# EAGLE design FIDO2AUTH_0022 (EAGLE 7.7.0)

## Sheet 1 of 3
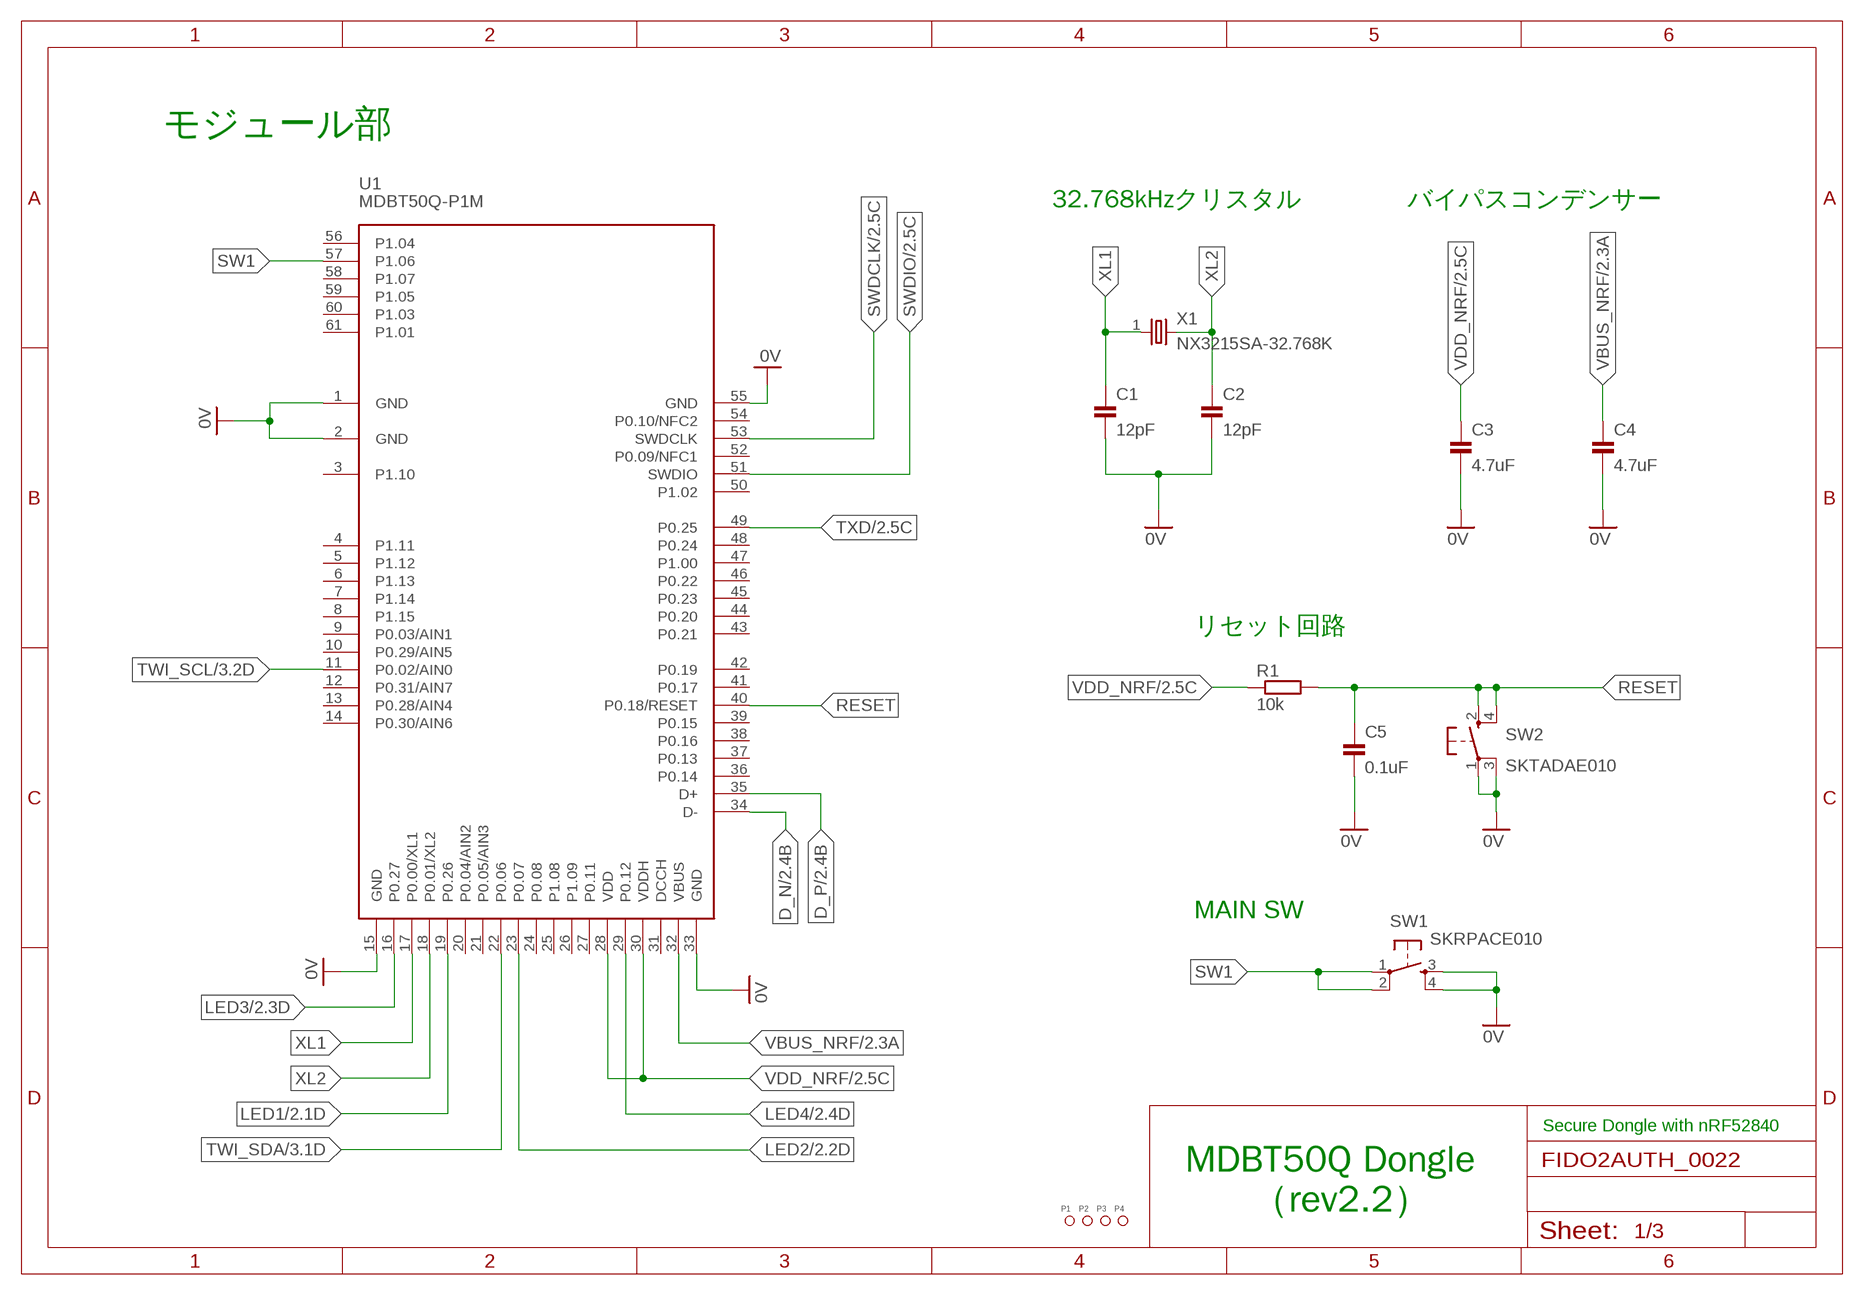
[diagram p0: schematic, sheet 1]

### Parts
C1  12pF  CAP_0603N  [C0603N]
C2  12pF  CAP_0603N  [C0603N]
C3  4.7uF  CAP_0603N  [C0603N]
C4  4.7uF  CAP_0603N  [C0603N]
C5  0.1uF  CAP_0402N  [C0402N]
P1  0  PAD-MARK  [ROUND-MARK-1.0]
P2  0  PAD-MARK  [ROUND-MARK-1.0]
P3  0  PAD-MARK  [ROUND-MARK-1.0]
P4  0  PAD-MARK  [ROUND-MARK-1.0]
R1  10k  RESISTOR_0402N  [R0402N]
SW1  SKRPACE010  [SKRPACE010]
SW2  SKTADAE010  [SKTADAE010]
U1  MDBT50Q-P1M  [MDBT50Q-P1M]
X1  NX3215SA-32.768K  [NX3215]

### Nets
0V: C1.2 C2.2 C3.2 C4.2 C5.2 SW1.3(S) SW1.4(S1) SW2.1(P) SW2.3(P1) U1.1(GND) U1.2(GND) U1.15(GND) U1.33(GND) U1.55(GND) ; also sheet 2,3
D_N: U1.34(D-) ; also sheet 2
D_P: U1.35(D+) ; also sheet 2
LED1: U1.19(P0.26) ; also sheet 2
LED2: U1.23(P0.07) ; also sheet 2
LED3: U1.16(P0.27) ; also sheet 2
LED4: U1.29(P0.12) ; also sheet 2
RESET: C5.1 R1.2 SW2.2(S) SW2.4(S1) U1.40(P0.18/RESET)
SW1: SW1.1(P) SW1.2(P1) U1.57(P1.06)
SWDCLK: U1.53(SWDCLK) ; also sheet 2
SWDIO: U1.51(SWDIO) ; also sheet 2
TWI_SCL: U1.11(P0.02/AIN0) ; also sheet 3
TWI_SDA: U1.22(P0.06) ; also sheet 3
TXD: U1.49(P0.25) ; also sheet 2
VBUS_NRF: C4.1 U1.32(VBUS) ; also sheet 2,3
VDD_NRF: C3.1 R1.1 U1.28(VDD) U1.30(VDDH) ; also sheet 2,3
XL1: C1.1 U1.17(P0.00/XL1) X1.1
XL2: C2.1 U1.18(P0.01/XL2) X1.2
Unconnected: U1.3(P1.10) U1.4(P1.11) U1.5(P1.12) U1.6(P1.13) U1.7(P1.14) U1.8(P1.15) U1.9(P0.03/AIN1) U1.10(P0.29/AIN5) U1.12(P0.31/AIN7) U1.13(P0.28/AIN4) U1.14(P0.30/AIN6) U1.20(P0.04/AIN2) U1.21(P0.05/AIN3) U1.24(P0.08) U1.25(P1.08) U1.26(P1.09) U1.27(P0.11) U1.31(DCCH) U1.36(P0.14) U1.37(P0.13) U1.38(P0.16) U1.39(P0.15) U1.41(P0.17) U1.42(P0.19) U1.43(P0.21) U1.44(P0.20) U1.45(P0.23) U1.46(P0.22) U1.47(P1.00) U1.48(P0.24) U1.50(P1.02) U1.52(P0.09/NFC1) U1.54(P0.10/NFC2) U1.56(P1.04) U1.58(P1.07) U1.59(P1.05) U1.60(P1.03) U1.61(P1.01)

### Notes on the sheet
- モジュール部
- 32.768kHzクリスタル | バイパスコンデンサー
- リセット回路
- MAIN SW
- Secure Dongle with nRF52840
- MDBT50Q Dongle
        （rev2.2）

## Sheet 2 of 3
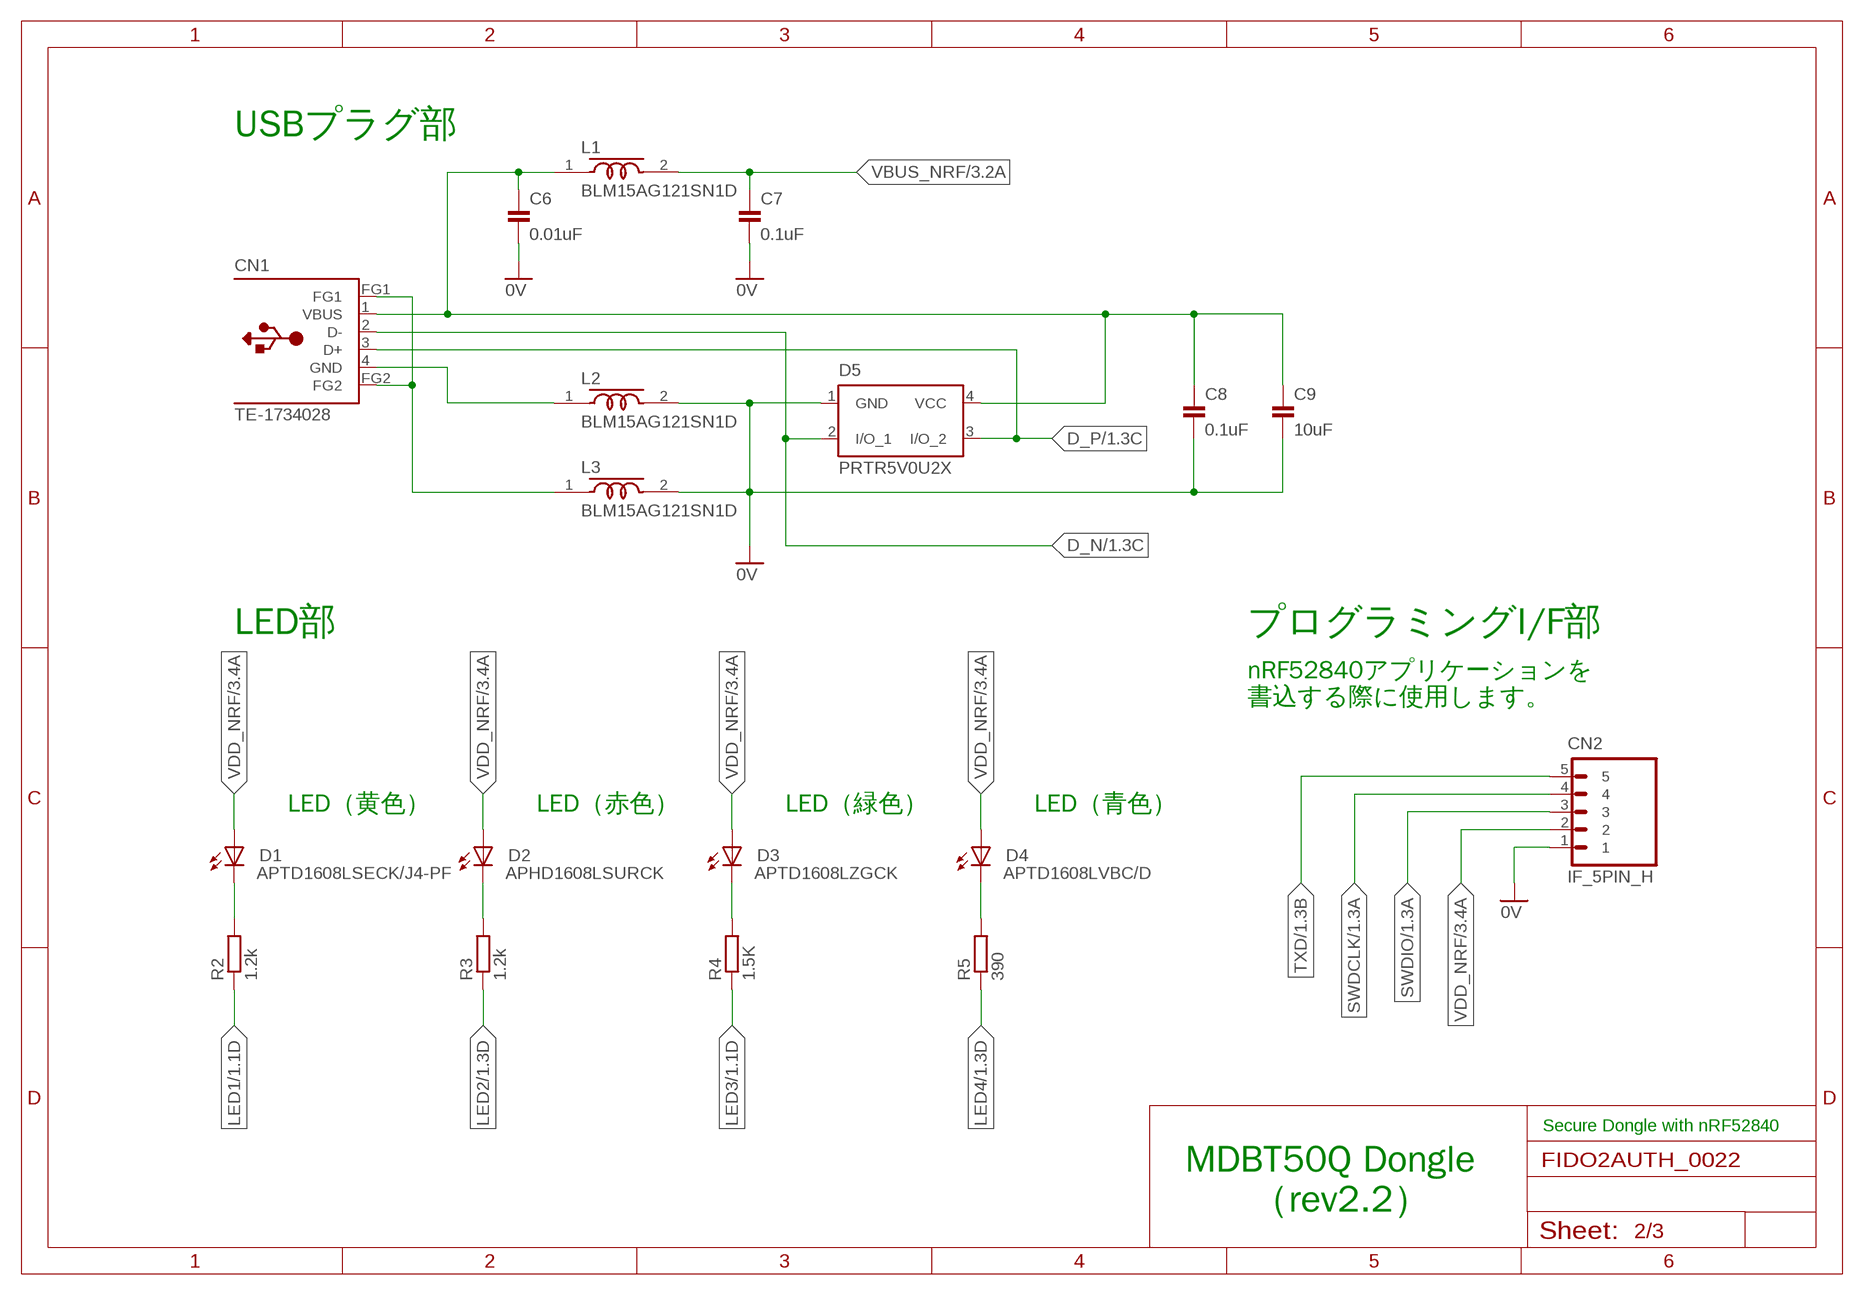
[diagram p1: schematic, sheet 2]

### Parts
C6  0.01uF  CAP_0402N  [C0402N]
C7  0.1uF  CAP_0402N  [C0402N]
C8  0.1uF  CAP_0402N  [C0402N]
C9  10uF  CAP_0603N  [C0603N]
CN1  TE-1734028  [TE-1734028]
CN2  IF_5PIN_H  [HEADER_5PIN]
D1  APTD1608LSECK/J4-PF  [APTD1608]
D2  APHD1608LSURCK  [APTD1608]
D3  APTD1608LZGCK  [APTD1608]
D4  APTD1608LVBC/D  [APTD1608]
D5  PRTR5V0U2X  [SOT143B]
L1  BLM15AG121SN1D  [C0402N]
L2  BLM15AG121SN1D  [C0402N]
L3  BLM15AG121SN1D  [C0402N]
R2  1.2k  RESISTOR_0402N  [R0402N]
R3  1.2k  RESISTOR_0402N  [R0402N]
R4  1.5K  RESISTOR_0402N  [R0402N]
R5  390  RESISTOR_0402N  [R0402N]

### Nets
0V: C6.2 C7.2 C8.2 C9.2 CN2.1 D5.1(GND) L2.2 L3.2 ; also sheet 1,3
D_N: CN1.2(D-) D5.2(I/O_1) ; also sheet 1
D_P: CN1.3(D+) D5.3(I/O_2) ; also sheet 1
LED1: R2.1 ; also sheet 1
LED2: R3.1 ; also sheet 1
LED3: R4.1 ; also sheet 1
LED4: R5.1 ; also sheet 1
N$1: D4.C R5.2
N$2: CN1.4(GND) L2.1
N$3: CN1.FG1 CN1.FG2 L3.1
N$6: D3.C R4.2
N$7: D2.C R3.2
N$8: D1.C R2.2
SWDCLK: CN2.4 ; also sheet 1
SWDIO: CN2.3 ; also sheet 1
TXD: CN2.5 ; also sheet 1
VBUS: C6.1 C8.1 C9.1 CN1.1(VBUS) D5.4(VCC) L1.1
VBUS_NRF: C7.1 L1.2 ; also sheet 1,3
VDD_NRF: CN2.2 D1.A D2.A D3.A D4.A ; also sheet 1,3

### Notes on the sheet
- USBプラグ部
- LED部 | プログラミングI/F部
- nRF52840アプリケーションを
  書込する際に使用します。
- LED（黄色） | LED（赤色） | LED（緑色） | LED（青色）
- Secure Dongle with nRF52840
- MDBT50Q Dongle
        （rev2.2）

## Sheet 3 of 3
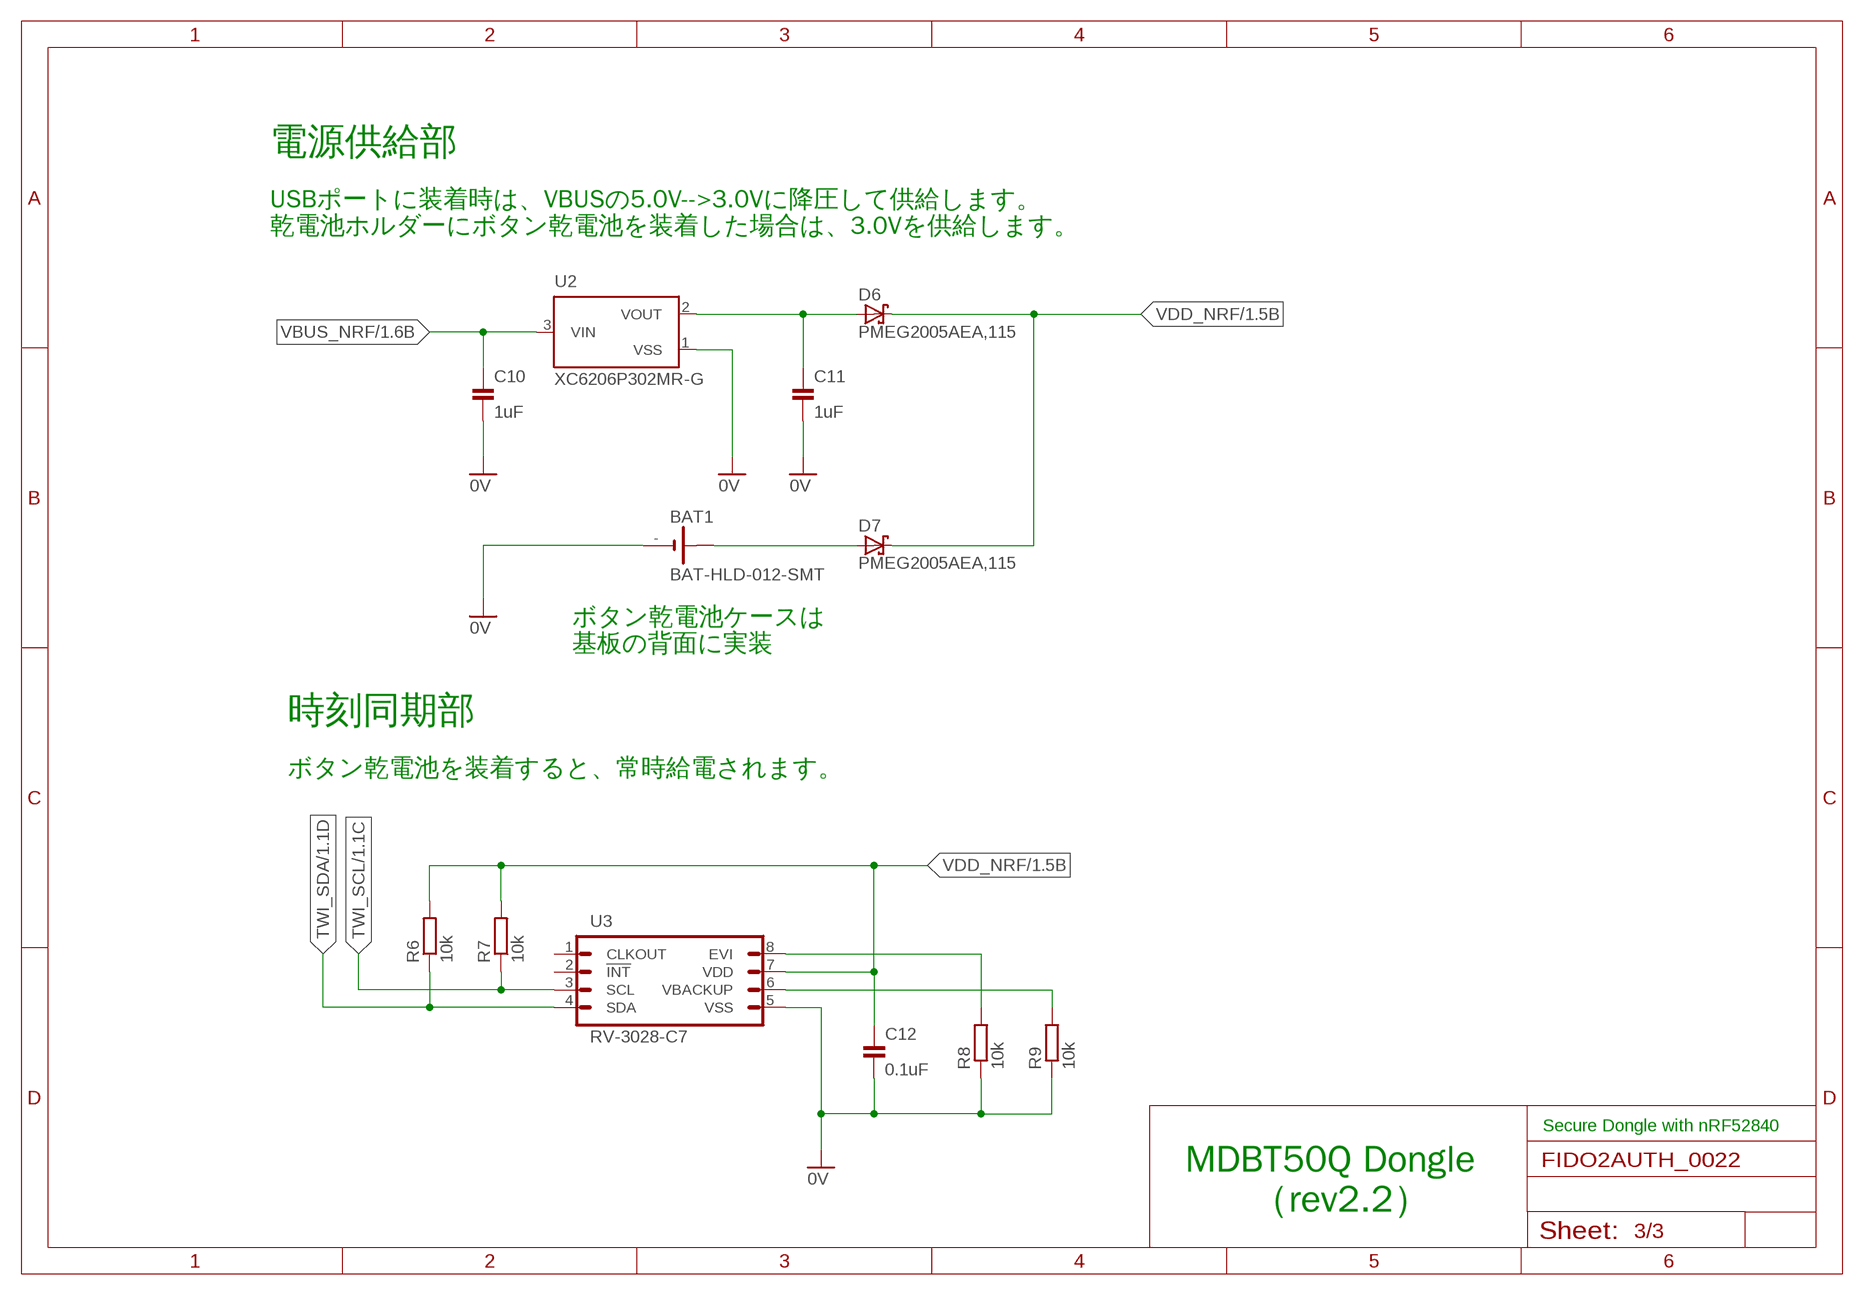
[diagram p2: schematic, sheet 3]

### Parts
BAT1  BAT-HLD-012-SMT  [BAT-HLD-012-SMT]
C10  1uF  CAP_0603N  [C0603N]
C11  1uF  CAP_0603N  [C0603N]
C12  0.1uF  CAP_0402N  [C0402N]
D6  PMEG2005AEA,115  [SOD323-W]
D7  PMEG2005AEA,115  [SOD323-W]
R6  10k  RESISTOR_0402N  [R0402N]
R7  10k  RESISTOR_0402N  [R0402N]
R8  10k  RESISTOR_0402N  [R0402N]
R9  10k  RESISTOR_0402N  [R0402N]
U2  XC6206P302MR-G  [SOT23]
U3  RV-3028-C7  [SON-8]

### Nets
0V: BAT1.- C10.2 C11.2 C12.2 R8.1 R9.1 U2.1(VSS) U3.5(VSS) ; also sheet 1,2
N$4: C11.1 D6.A U2.2(VOUT)
N$5: BAT1.+@2(+) D7.A
N$9: R9.2 U3.6(VBACKUP)
N$10: R8.2 U3.8(EVI)
TWI_SCL: R7.1 U3.3(SCL) ; also sheet 1
TWI_SDA: R6.1 U3.4(SDA) ; also sheet 1
VBUS_NRF: C10.1 U2.3(VIN) ; also sheet 1,2
VDD_NRF: C12.1 D6.C D7.C R6.2 R7.2 U3.7(VDD) ; also sheet 1,2
Unconnected: U3.1(CLKOUT) U3.2(!INT!)

### Notes on the sheet
- 電源供給部
- USBポートに装着時は、VBUSの5.0V-->3.0Vに降圧して供給します。
  乾電池ホルダーにボタン乾電池を装着した場合は、3.0Vを供給します。
- ボタン乾電池ケースは
  基板の背面に実装
- 時刻同期部
- ボタン乾電池を装着すると、常時給電されます。
- Secure Dongle with nRF52840
- MDBT50Q Dongle
        （rev2.2）

## Library data of the parts
BAT1 = Connectors:BAT-HLD-012-SMT: ボタン電池ホルダー(CR1216/1225)
C1-C12 = Parts:CAP: コンデンサー
CN1 = Connectors:TE-1734028: USB connector plug TE Connectivity
CN2 = Connectors:IF_5PIN: 5-pin インターフェース
D1 D3 D4 = Parts:APTD1608: 発光ダイオード
D2 = Parts:APHD1608: 発光ダイオード
D5 = Parts:PRTR5V0U2X: ESD protection diode
D6 D7 = Parts:PMEG2005: ショットキーダイオード If - 順電流: 500 mA Vrrm - 繰返し逆電圧: 20 V Vf - 順電圧: 0.39 V Ifsm - 順方向サージ電流: 10 A 最低動作温度: - 65 C 最高動作温度: + 150 C
L1-L3 = Parts:BLM15AG: フェライトビーズ EMIFIL®
P1-P4 = Generic:PAD-MARK; PARTNO: DNP
R1-R9 = Parts:RESISTOR: 抵抗器
SW1 = Parts:SKRPACE010: 表面実装用タクトスイッチ ４．２×３．２ｍｍ小型重作動力タイプ ・作動力：２．５５Ｎ ・操作方向：垂直 ・移動量：０．２ｍｍ ・動作寿命：５０，０００ｃｙｃｌｅｓ （５ｍＡ ５ＶＤＣ） ・初期接触抵抗：最大５００ｍΩ
SW2 = Parts:SKTADAE010: 表面実装用タクトスイッチ 2.6×1.6ｍｍ小型重作動力タイプ ・作動力：2.4 N ・操作方向：垂直 ・移動量：0.11 mm ・定格：50 mA 12 VDC
U1 = Modules:MDBT50Q-P1M: MDBT50Q – P1M (PCB Antenna) Bluetooth 5, IEEE 802.15.4, 2.4 GHz transceiver ARM Cortex –M4 32-bit processor with FPU, 64 MHz Memory: 1MB flash / 256KB RAM ‧Supply voltage range 1.7V to 5.5V ‧On-chip DC/DC and LDO regulators with automated low current modes ‧Regulated supply for external components from 1.8V to 3.3V ‧0.4uA at 3V in System OFF mode, no RAM retention ‧1.5uA at 3V in System ON mode, no RAM retention, wake on RTC Working distance 1Mbps: up to 250 meters in open space 2Mbps: up to 120 meters in open space
U2 = Parts:XC6206: 電圧レギュレータ 出力電圧: 3.3 V 出力電流: 200 mA 入力電圧最大値: 6 V 最小入力電圧: 1.8 V 動作供給電流: 1 uA 最低動作温度: - 40 C 最高動作温度: + 85 C
U3 = ICs:RV-3028-C7: Extreme Low Power RTC Module Supply Voltage: 1.2 V 〜 5.5 V Operating Temperature: - 40 C 〜 + 85 C 3.2 mm x 1.5 mm
X1 = Parts:NX3215SA: 水晶振動子 周波数 32.768kHz 周波数公差 ±20ppm 負荷容量 6pF ESR（等価直列抵抗） 70 kOhms 動作温度 -40°C～85°C

## Board
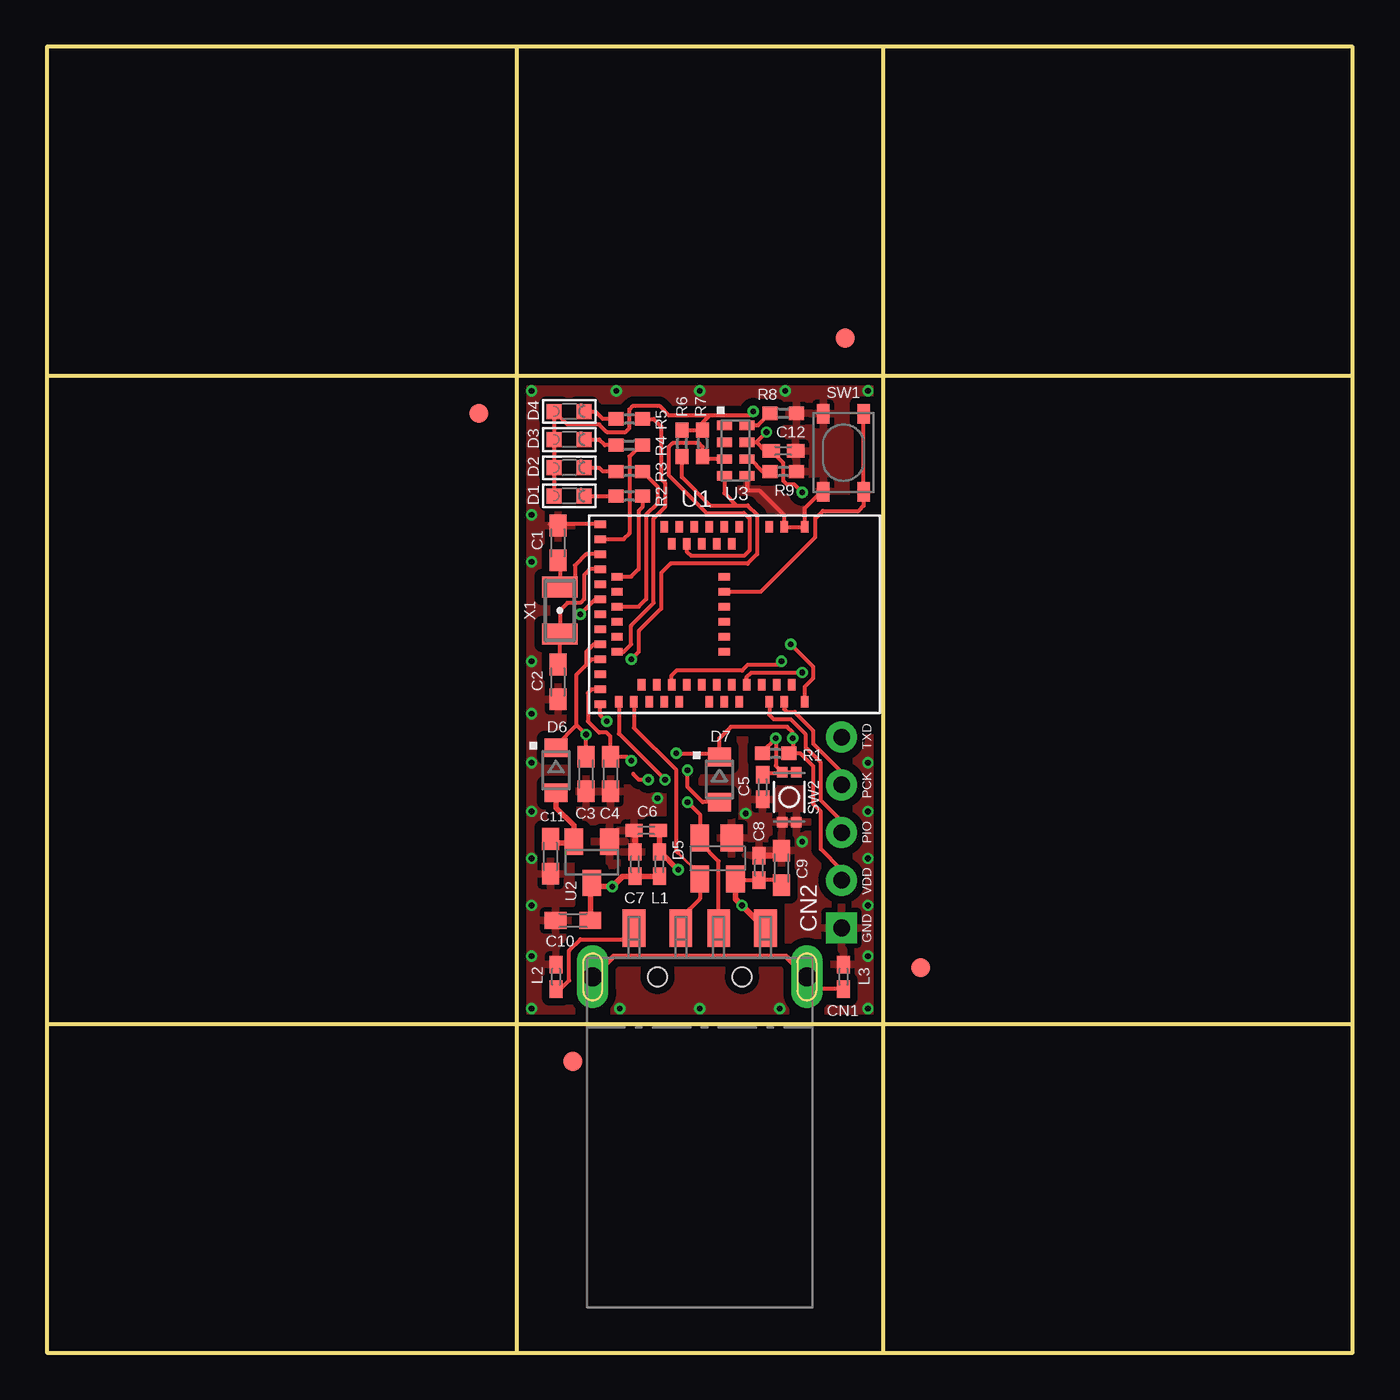
[diagram p3: board, top side]
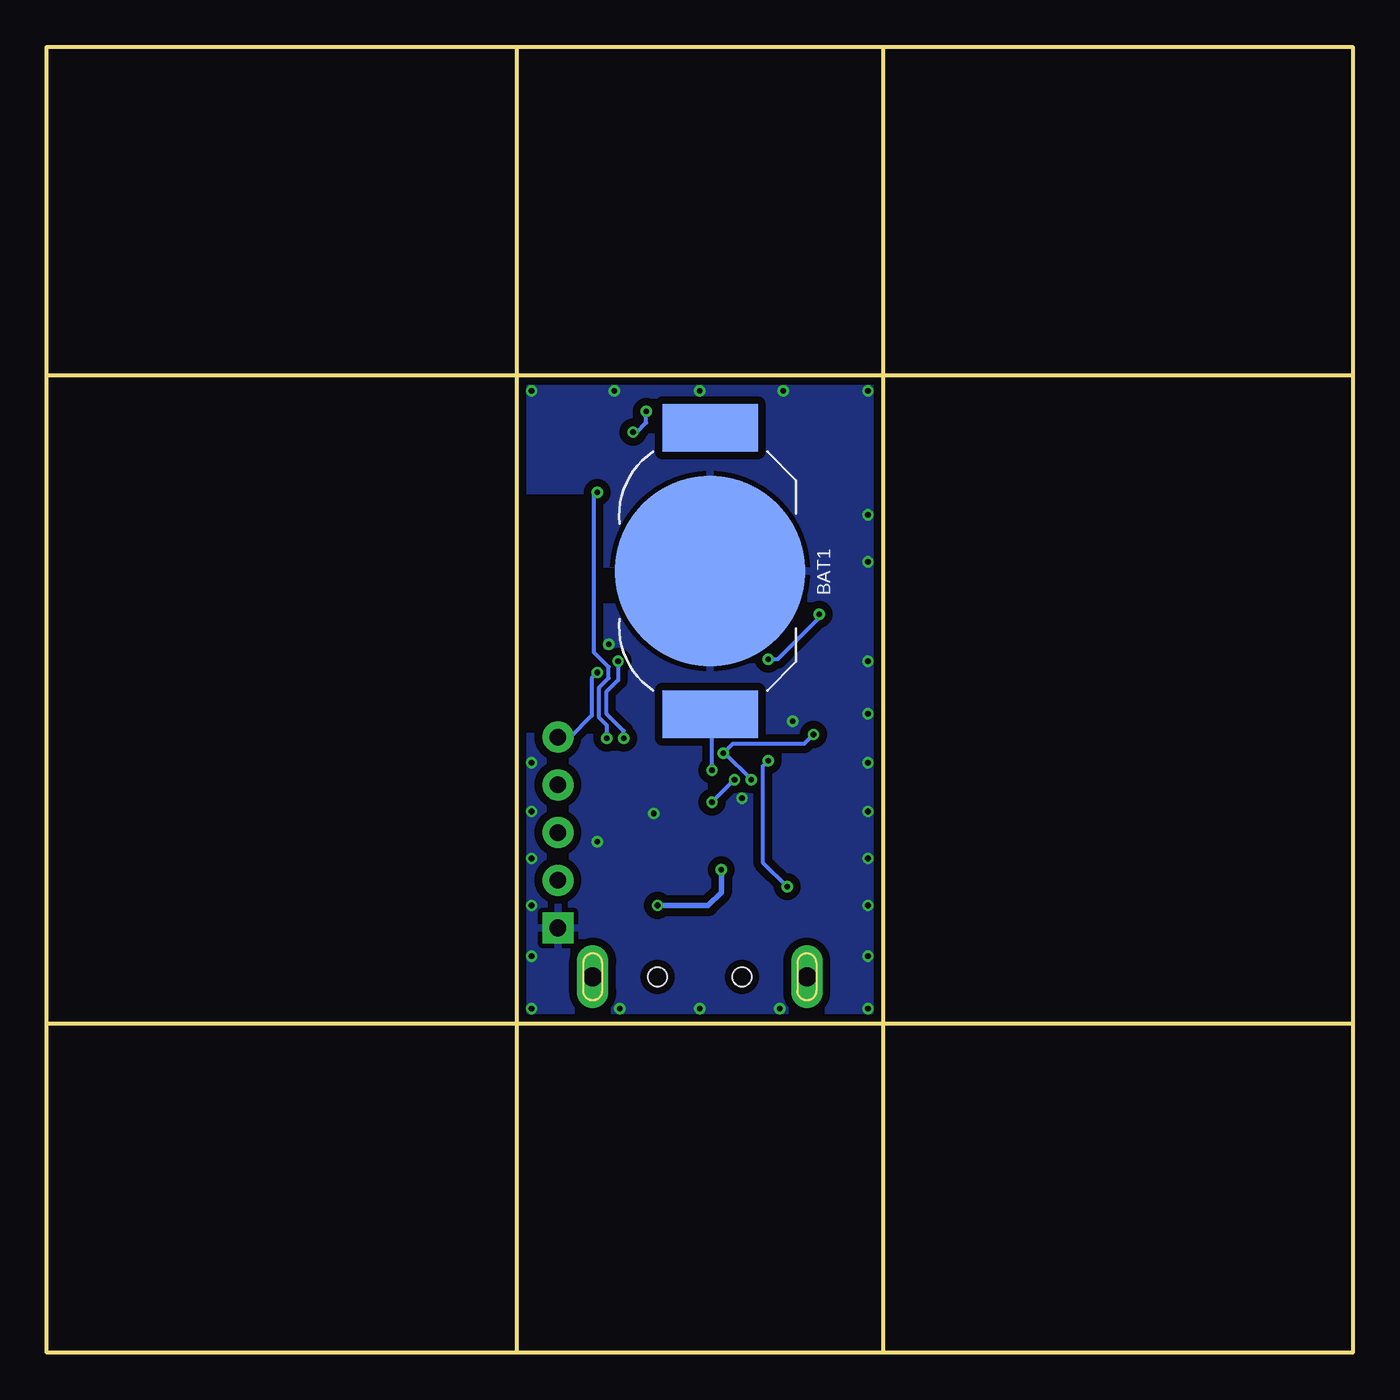
[diagram p4: board, bottom side, seen from below]

Size 69.5 x 69.5 mm. Coordinates in mm from the lower left corner, seen from the top.
Outline: 0,17.5 69.5,17.5
Outline: 0,52 69.5,52
Outline: 25,69.5 25,0
Outline: 44.5,69.5 44.5,0
Outline: 0,0 69.5,0 69.5,69.5 0,69.5 0,0
Copper layers (1*16): Top 0.035mm / dielectric 1.5mm / Bottom 0.035mm
Design rules "SeeedStudio_2layer_DRU_no_angle_20140221 *": minimum track width 6mil, minimum drill 0.3mm, track to track 6mil, track to pad 6mil, pad to pad 6mil, via to via 6mil, smd to smd 0mil, copper to edge 10mil, drill to drill 10mil, minimum pad ring 10mil, minimum via ring 6mil, stop-mask expansion 2mil, vias tented up to drill 100mil, thermal gap 10mil

### Footprints (pad centres in the part's own frame; a part is rotated, then mirrored left to right if it is on the bottom)
BAT-HLD-012-SMT = smd 2.54 x 5.08: +@1 -7.62,0; +@2 7.62,0 | smd 10.16 x 10.16: - 0,0
C0603N = smd 1.15 x 0.9: 1 -0.925,0; 2 0.925,0
C0402N = smd 0.925 x 0.7: 1 -0.65,0; 2 0.65,0
TE-1734028 = smd 1.2 x 2: 1 3.5,2.6; 2 1,2.6; 3 -1,2.6; 4 -3.5,2.6 | drill 1 pad 1.676 long: FG1 5.7,0; FG2 -5.7,0 | hole 1: -2.25,0; 2.25,0
HEADER_5PIN = drill 0.889 pad 1.651 square: 1 0,0 | drill 0.889 pad 1.651: 2 2.54,0; 3 5.08,0; 4 7.62,0; 5 10.16,0
APTD1608 = smd 0.8 x 0.8: A -0.8,0; C 0.8,0
SOT143B = smd 1.2 x 1.44: 1 -0.75,-1.1 | smd 1 x 1.44: 2 0.95,-1.1; 3 0.95,1.1; 4 -0.95,1.1
SOD323-W = smd 1 x 1.2: A 1.2,0; C -1.2,0
ROUND-MARK-1.0 = smd 1 x 1: P$1 0,0
R0402N = smd 0.8 x 0.7: 1 -0.7,0; 2 0.7,0
SKRPACE010 = smd 1.05 x 0.65: 1 -2.075,1.075; 2 2.075,1.075; 3 -2.075,-1.075; 4 2.075,-1.075
SKTADAE010 = smd 0.55 x 0.55: 1 -1.325,0.375; 2 1.325,0.375; 3 -1.325,-0.375; 4 1.325,-0.375
MDBT50Q-P1M = smd 0.6 x 0.4: 1 -4.65,3.75; 2 -4.65,2.65; 3 -4.65,1.85; 4 -4.65,0.25; 5 -3.75,-0.15; 6 -4.65,-0.55; 7 -3.75,-0.95; 8 -4.65,-1.35; 9 -3.75,-1.75; 10 -4.65,-2.15; 11 -3.75,-2.55; 12 -4.65,-2.95; 13 -3.75,-3.35; 14 -4.65,-3.75; 34 4.65,-6.15; 35 4.65,-5.35; 36 3.75,-4.95; 37 4.65,-4.55; 38 3.75,-4.15; 39 4.65,-3.75; 40 3.75,-3.35; 41 4.65,-2.95; 42 3.75,-2.55; 43 3.75,-1.75; 44 4.65,-1.35; 45 3.75,-0.95; 46 4.65,-0.55; 47 3.75,-0.15; 48 4.65,0.25; 49 3.75,0.65; 50 3.75,1.45; 51 4.65,1.85; 52 3.75,2.25; 53 4.65,2.65; 54 3.75,3.05; 55 4.65,3.75 | smd 0.4 x 0.6: 15 -4.8,-7.15; 16 -4,-7.15; 17 -3.2,-7.15; 18 -2.4,-7.15; 19 -2,-6.25; 20 -1.6,-7.15; 21 -1.2,-6.25; 22 -0.8,-7.15; 23 -0.4,-6.25; 24 0,-7.15; 25 0.4,-6.25; 26 0.8,-7.15; 27 1.2,-6.25; 28 1.6,-7.15; 29 2,-6.25; 30 2.4,-7.15; 31 3.2,-7.15; 32 4,-7.15; 33 4.8,-7.15; 56 -2,-0.55; 57 -1.2,-0.55; 58 -0.4,-0.55; 59 0.4,-0.55; 60 1.2,-0.55; 61 2,-0.55
SOT23 = smd 1 x 1.4: 1 -0.95,-1.1; 2 0.95,-1.1; 3 0,1.1
SON-8 = smd 0.5 x 0.8: 1 0.25,0.4; 2 1.15,0.4; 3 2.05,0.4; 4 2.95,0.4; 5 2.95,1.6; 6 2.05,1.6; 7 1.15,1.6; 8 0.25,1.6
NX3215 = smd 1.1 x 1.9: 1 -1.25,0; 2 1.25,0

### Placement (x,y rotation side)
BAT1  34.2,41.6 270 bottom
C1  27.2,43.1 90 top
C2  27.2,35.7 270 top
C3  28.7,30.8 270 top
C4  30,30.8 270 top
C5  38.1,30.1 270 top
C6  31.9,27.8 180 top
C7  31.3,26 90 top
C8  37.9,25.8 90 top
C9  39.1,25.8 90 top
C10  28,23 180 top
C11  26.8,26.41 270 top
C12  39.2,48 0 top
CN1  34.75,20 0 top
CN2  42.3,22.6 90 top
D1  27.8,45.6 0 top
D2  27.8,47.1 0 top
D3  27.8,48.6 0 top
D4  27.8,50.1 0 top
D5  35.7,26.3 180 top
D6  27.1,31 270 top
D7  35.8,30.5 270 top
L1  32.6,26 270 top
L2  27.1,20 90 top
L3  42.4,20 90 top
P1  28,15.5 0 top
P2  42.5,54 0 top
P3  23,50 0 top
P4  46.5,20.5 0 top
R1  38.8,31.9 180 top
R2  31,45.6 180 top
R3  31,46.9 180 top
R4  31,48.3 180 top
R5  31,49.7 180 top
R6  33.8,48.4 90 top
R7  34.9,48.4 90 top
R8  39.2,50 180 top
R9  39.2,46.9 180 top
SW1  42.4,47.9 270 top
SW2  39.51,29.56 90 top
U1  36.6,39.3 270 top
U2  29,26.1 180 top
U3  35.66,49.61 270 top
X1  27.3,39.5 270 top

### Tracks (layer width: path | path; a pad name or v marks a point on that pad's centre or on a via)
0V  (via drill 0.3)
  Top 0.203: U1.15 26.77,44.1 C1.2 | SW1.4 41.23,45.83 40.35,44.95 U1.1 U1.2 39.25,44.55 37.9,45.9 37.3,45.9 37.26,45.94 U3.5 | v29.8,33.6 29.45,33.95 U1.33 | U1.55 40.35,35.45 40.8,35.9 40.8,36.5 v39.6,37.7
  Top 0.305: C7.2 31.3,27.75 C6.2 | C9.2 38.83,26.45 C8.2
  other vias: 43.7,31.4 43.7,28.8 43.7,26.3 43.7,23.8 43.7,21.1 43.7,18.3 25.8,18.3 25.8,21.1 25.8,23.8 25.8,28.8 25.8,26.3 25.8,31.4 25.8,42.1 25.8,36.8 25.8,44.6 25.8,34 34.75,51.2 43.7,51.2 25.8,51.2 30.3,51.2 39.3,51.2 32.5,29.5 34.75,18.3 30.5,18.3 39,18.3 37.2,28.7 40.2,27.2
  pour Bottom (isolate 0.406, rank 3): 22.46,14.96 46.59,14.96 46.59,32.8 40.25,32.8 40.25,39.69 38.98,39.69 38.98,41.97 40.25,41.97 40.25,45.88 46.59,45.88 46.59,54.33 22.46,54.33
  pour Top (isolate 0.406, rank 3): 23.73,53.06 45.32,53.06 45.32,45.86 40.1,45.86 40.1,44.7 28.9,44.7 28.9,45.9 27.92,45.86 27.92,32.72 45.32,32.72 45.32,16.23 23.73,16.23
D_N  (via drill 0.3)
  Top 0.203: CN1.2 35.75,26.15 34.75,27.15 D5.2 34.75,28.65 v34.1,29.3 | U1.34 30.45,32.95 v32.9,30.5
  Bottom 0.203: v32.9,30.5 v34.1,29.3
D_P
  Top 0.152: D5.3 34.75,25.45 33.6,26.6
  Top 0.203: CN1.3 33.75,23.15 34.75,24.15 D5.3 | 33.6,26.6 33.5,26.7 33.5,31 31.25,33.25 U1.35
LED1
  Top 0.203: U1.19 31.1,41.3 31.5,41.7 31.5,44.8 31.7,45 R2.1
LED2
  Top 0.203: R3.1 32.5,46.1 32.5,45.2 31.9,44.6 31.9,40.1 31.5,39.7 U1.23
LED3
  Top 0.203: R4.1 31.6,48.3 31,47.7 31,43.6 30.7,43.3 U1.16
LED4
  Top 0.203: R5.1 32.3,49.7 32.7,49.3 32.7,46.5 32.9,46.3 32.9,45 32.3,44.4 32.3,39.9 31.1,38.7 31.1,37.7 30.7,37.3 U1.29
N$1
  Top 0.203: D4.C 29.2,50.1 29.6,49.7 R5.2
N$2
  Top 0.203: L2.1 27.35,19.35 27.8,19.8 27.8,21.4 28.4,22 30.65,22 CN1.4
N$3
  Top 0.203: L3.1 41.1,19.35 CN1.FG1
  Top 0.305: CN1.FG1 39.35,21.1 30.15,21.1 CN1.FG2
N$4
  Top 0.305: C11.1 27,27.14 27.81,27.14 U2.2 28.05,28.05 27.1,29 D6.A
N$5  (via drill 0.3)
  Top 0.203: D7.A 34.9,29.3 34.1,30.1 v34.1,31
  Bottom 0.203: v34.1,31 34.1,33.93 BAT1.+@2
N$6
  Top 0.203: R4.2 29.7,48.3 29.4,48.6 D3.C
N$7
  Top 0.203: R3.2 29.6,46.9 29.4,47.1 D2.C
N$8
  Top 0.203: D1.C R2.2
N$9
  Top 0.203: U3.6 37.44,47.56 38.1,46.9 R9.2
N$10
  Top 0.203: U3.8 37.86,49.36 R8.2
RESET  (via drill 0.3)
  Top 0.203: SW2.4 SW2.2 | U1.40 33.25,36.05 33.5,36.3 37,36.3 37.3,36.6 38.9,36.6 v39.1,36.8 | 37.85,30.75 C5.1 38.2,30.85 39.1,30.85 SW2.2 | SW2.2 38.8,31.23 v38.8,32.7 38.1,32 R1.2
  Bottom 0.203: v38.8,32.7 38.8,33.1 39.7,34 39.7,35.2 39.1,35.8 v39.1,36.8
SW1
  Top 0.203: U1.57 38,40.5 40.9,43.4 40.9,44.4 41.3,44.8 43.2,44.8 43.48,45.08 SW1.2 SW1.1
SWDCLK
  Top 0.203: U1.53 39.25,34.25 39.4,34.1 39.8,34.1 40.8,33.1 40.8,32.4 42.3,30.9 CN2.4
SWDIO
  Top 0.203: U1.51 38.45,33.95 38.7,33.7 39.6,33.7 40.4,32.9 40.4,32.2 41.2,31.4 41.2,29.4 42.3,28.3 CN2.3
TWI_SCL
  Top 0.203: U1.11 34.05,42.65 34.3,42.4 37.1,42.4 37.4,42.7 37.4,44.4 37.1,44.7 35.1,44.7 33.1,46.7 33.1,48.2 33.3,48.4 34.7,48.4 34.9,48.2 R7.1 35.04,47.56 U3.3
TWI_SDA  (via drill 0.3)
  Top 0.203: R6.1 33.8,46.6 35.3,45.1 36.7,45.1 | 36.7,45.1 37.3,45.1 37.8,44.6 37.8,42.5 37.3,42 33.2,42 32.7,41.5 32.7,39.6 31.5,38.4 31.5,37.3 v31.1,36.9 | U3.4 36.06,45.74 36.7,45.1 | v28.4,39.3 29.2,40.1 U1.22
  Bottom 0.203: v28.4,39.3 28.4,39.1 30.6,36.9 v31.1,36.9
TXD  (via drill 0.3)
  Top 0.203: U1.49 37.25,35.95 37.5,36.2 v40.2,36.2
  Bottom 0.203: v40.2,36.2 40.5,35.9 40.5,33.9 41.64,32.76 CN2.5
VBUS  (via drill 0.3)
  Top 0.203: D5.4 36.7,25.15 C8.1 38.83,25.15 C9.1
  Top 0.305: CN1.1 38.2,22.6 v37,23.8 36.65,24.15 D5.4 | v33.6,25.7 32.65,26.65 L1.1 32.6,27.75 C6.1
  Bottom 0.305: v37,23.8 34.3,23.8 33.6,24.5 v33.6,25.7
VBUS_NRF  (via drill 0.3)
  Top 0.203: U1.32 29,35.3 28.8,35.1 28.8,33.6 29.4,33 29.8,33 30,32.8 C4.1 30.88,31.73 v31.1,31.5 30.9,31.7
  Top 0.305: L1.2 C7.1 30.65,25.35 v30.1,24.8 29.2,24.8 U2.3 28.93,24.77 C10.1
  Bottom 0.203: v31.1,31.5 31.4,31.2 31.4,26.1 v30.1,24.8
VDD_NRF  (via drill 0.3)
  Top 0.203: U3.7 37.76,48.46 | 37.76,48.46 v38.3,49 | 28.2,33.4 28.2,36.1 28.7,36.6 | 28.7,36.6 29,36.9 U1.30 | U1.28 29.1,37.7 28.7,37.3 28.7,36.6 | v33.5,31.9 35.6,31.9 D7.C 35.8,32.7 36.4,33.3 39.4,33.3 39.7,33 v39.7,32.7 39.7,32.1 R1.1 40.1,31.9 40.8,31.2 40.8,29.2 41.2,28.8 41.2,26.8 42.3,25.7 CN2.2 | 31.2,30.8 31.5,30.5 v32,30.5 | R6.2 R7.2 34.9,49.5 35.3,49.9 | 35.3,49.9 37.4,49.9 v37.6,50.1 | v40.2,45.8 39.8,46.2 39.4,46.2 39.2,46.4 39.2,47.35 C12.1 38.22,48 37.76,48.46 | 35.3,49.9 33.1,49.9 32.6,50.4 31.2,50.4 31,50.2 31,49.2 30.8,49 29.8,49 29.4,49.4 27.7,49.4 D4.A D3.A D2.A D1.A | 28.2,33.4 v28.7,32.9 C3.1 | 28.2,33.4 27.1,32.3 D6.C
  Bottom 0.203: v39.7,32.7 39.7,33.4 40.1,33.8 40.1,35.4 39.6,35.9 39.6,36.5 40.4,37.3 40.4,45.6 v40.2,45.8 | v32,30.5 33.4,31.9 v33.5,31.9 33,32.4 29.2,32.4 v28.7,32.9 | v38.3,49 38.1,49 37.6,49.5 v37.6,50.1
XL1
  Top 0.203: U1.17 28.7,42.5 28.1,41.9 28.1,41.1 27.75,40.75 X1.1 27.3,42.08 C1.1
XL2
  Top 0.203: U1.18 28.9,41.7 28.6,41.4 28.6,40.1 28.4,39.9 27.7,39.9 27.3,39.5 X1.2 27.3,36.73 C2.1

### Text on the board
tPlace: TXD | PCK | PIO | VDD | GND